# Altium schematic sheet [2] Led_Driver.SchDoc: Led Driver
size A4; DocumentNumber: 02; Revision: 01
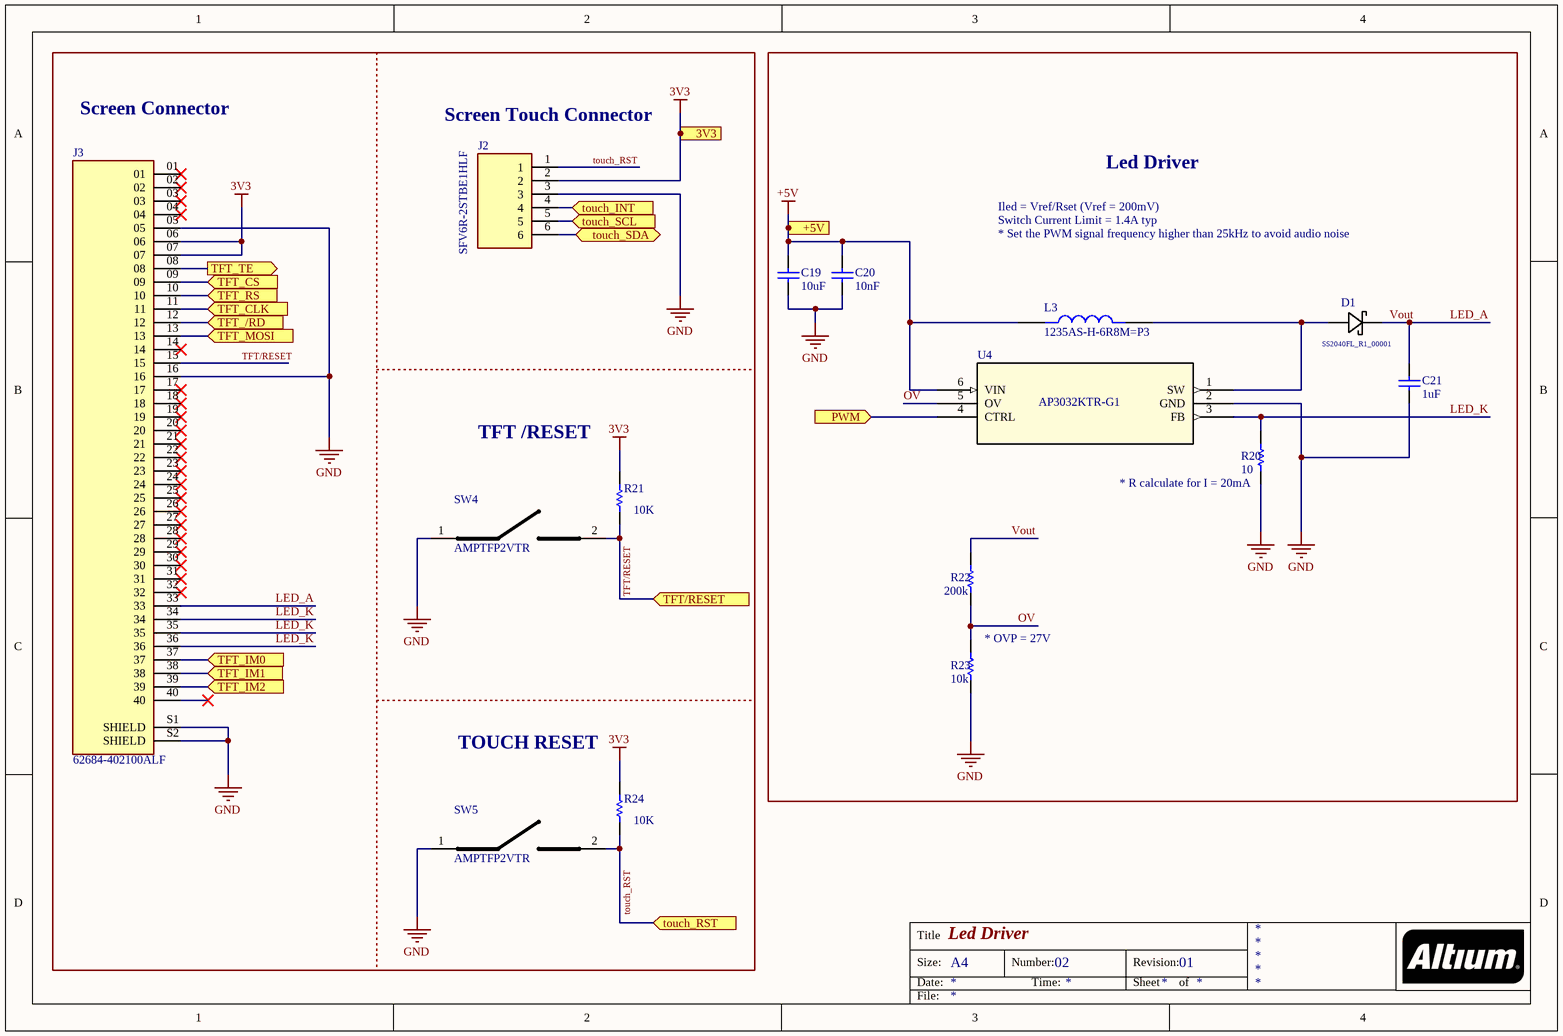
[diagram p0: [2] Led_Driver.SchDoc]

## Parts
C19  10uF  [Capacitor 0402]
C20  10nF  [Capacitor 0402]
C21  1uF  [Capacitor 0402]
D1  SS2040FL_R1_00001  [CR_R1_00001_PNJ]
J2  SFV6R-2STBE1HLF  [AMPHENOL_SFV6R-2STBE1HLF]
J3  62684-402100ALF  [AMPHENOL_62684-402100ALF]
L3  1235AS-H-6R8M=P3  [IND_1235AS-H-6R8M=P3]
R20  10  [Resistencia 0402]
R21  10K  [Resistencia 0402]
R22  200k  [Resistencia 0402]
R23  10k  [Resistencia 0402]
R24  10K  [Resistencia 0402]
SW4  AMPTFP2VTR  [AMPTFP2VTR]
SW5  AMPTFP2VTR  [AMPTFP2VTR]
U4  AP3032KTR-G1  [SOT23-6_DIO]

## Blocks framed on the sheet
Led Driver: C19-C21 D1 L3 R20 R22 R23 U4

## Ports
3V3, +5V, PWM (in), TFT/RESET (in), TFT_/RD (in), TFT_CLK (in), TFT_CS (in), TFT_IM0 (in), TFT_IM1 (in), TFT_IM2 (in), TFT_MOSI (in), TFT_RS (in), TFT_TE (out), touch_INT (in), touch_RST (in), touch_SCL (in), touch_SDA (bidir)

## Nets
3V3: J2.2 J3.06 J3.07 R21.2(B) R24.2(B) ; port 3V3
+5V: C19.2 C20.2 L3.1 U4.6(VIN) ; port +5V
GND: C19.1 C20.1 C21.1 J2.3 J3.05 J3.16 J3.S1(SHIELD) J3.S2(SHIELD) R20.1(A) R23.1(A) SW4.1(COM) SW5.1(COM) U4.2(GND)
LED_A: C21.2 D1.1 J3.33 R22.2(B)  [also labelled Vout]
LED_K: J3.34 J3.35 J3.36 R20.2(B) U4.3(FB)
OV: R22.1(A) R23.2(B) U4.5(OV)
PWM: U4.4(CTRL) ; port PWM
TFT/RESET: J3.15 R21.1(A) SW4.2(NO) ; port TFT/RESET
TFT_/RD: J3.12 ; port TFT_/RD
TFT_CLK: J3.11 ; port TFT_CLK
TFT_CS: J3.09 ; port TFT_CS
TFT_IM0: J3.37 ; port TFT_IM0
TFT_IM1: J3.38 ; port TFT_IM1
TFT_IM2: J3.39 ; port TFT_IM2
TFT_MOSI: J3.13 ; port TFT_MOSI
TFT_RS: J3.10 ; port TFT_RS
TFT_TE: J3.08 ; port TFT_TE
touch_INT: J2.4 ; port touch_INT
touch_RST: J2.1 R24.1(A) SW5.2(NO) ; port touch_RST
touch_SCL: J2.5 ; port touch_SCL
touch_SDA: J2.6 ; port touch_SDA
NetD1_2: D1.2 L3.2 U4.1(SW)

Not connected (* = marked no-connect by the designer): J3 01* 02* 03* 04* 14* 17* 18* 19* 20* 21* 22* 23* 24* 25* 26* 27* 28* 29* 30* 31* 32* 40*

## Notes on the sheet
- Screen Connector
- (near J2) Screen Touch Connector
- Iled = Vref/Rset (Vref = 200mV)
- Switch Current Limit = 1.4A typ
- * Set the PWM signal frequency higher than 25kHz to avoid audio noise
- TFT /RESET
- (near R20) * R calculate for I = 20mA
- (near R23) * OVP = 27V
- TOUCH RESET
- Title
- Size:
- Date:
- A4
- Number:
- Time:
- Revision:
- Sheet
- of
- File:

## Library data of the parts
C19-C21 = Capacitor 0402: Capacitor Ceramico SMD 0402
D1 = SS2040FL_R1_00001: Description; Manufacturer_Name: Panjit; Copyright: Copyright (C) 2026 Ultra Librarian. All rights reserved.; Manufacturer_Part_Number: SS2040FL_R1_00001
J3 = 62684-402100ALF: Conn Rect FPC/FFC 40Cnt SMT OPUSeries ZIF 0.5mmPitch RtAngle | Amphenol FCI (Amphenol CS) 62684-402100ALF; MF: Amphenol ICC; SnapEDA_Link: https://www.snapeda.com/parts/62684-402100ALF/Amphenol+FCI/view-part/?ref=snap; Package: None; Value: *; MP: 62684-402100ALF; Check_prices: https://www.snapeda.com/parts/62684-402100ALF/Amphenol+FCI/view-part/?ref=eda
L3 = 1235AS-H-6R8M=P3: Inductor with Inductance: 6.8uH Tol. +/-20%, Package: 1818 (4745); MF: Murata; Purchase-URL: https://pricing.snapeda.com/search/part/1235AS-H-6R8M=P3/?ref=eda; Package: NONSTANDARD; MP: 1235AS-H-6R8M=P3; Value: *; SnapEDA_Link: https://www.snapeda.com/parts/1235AS-H-6R8M=P3/Murata/view-part/1512974/?ref=snap; Check_prices: https://www.snapeda.com/parts/1235AS-H-6R8M=P3/Murata/view-part/1512974/?ref=eda; Digi-Key_Part_Number: 490-14206-1-ND
R20-R24 = Resistencia SMD 0402
SW4 SW5 = AMPTFP2VTR: Tactile Switch SPST-NO Top Actuated Surface Mount; Manufacturer_Name: Apem; Geometry.Height: 2.2mm; Mouser Part Number: 642-AMPTFP2VTR; Mouser Price/Stock: https://www.mouser.co.uk/ProductDetail/Apem/AMPTFP2VTR?qs=%252B9%2Fcbd0IE0SYwG%252BIJFZl2Q%3D%3D; Manufacturer_Part_Number: AMPTFP2VTR; Datasheet Link: https://www.mouser.se/datasheet/2/26/apem_appms00196-1-1733699.pdf
U4 = AP3032KTR-G1: Description; Manufacturer_Name: Diodes Inc; Copyright: Copyright (C) 2025 Ultra Librarian. All rights reserved.; Manufacturer_Part_Number: AP3032KTR-G1; RefDes: RefDes; Type: Type
J2 = SFV6R-2STBE1HLF: Package: None; Price: None; Value: *; MP: SFV6R-2STBE1HLF; Availability: Unavailable